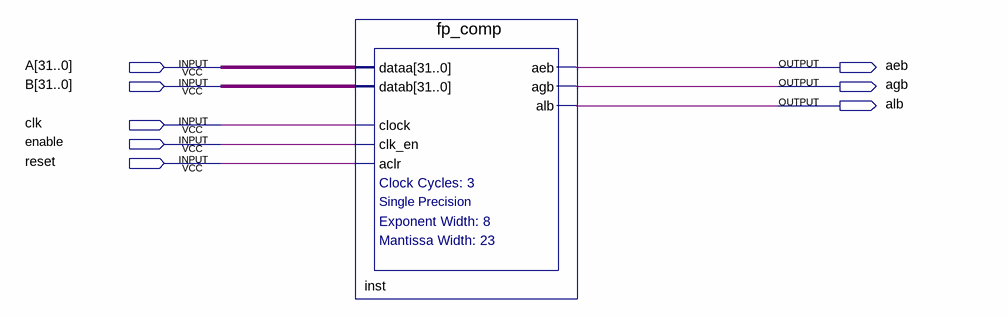
[diagram p0: schematic sheet]
// Quartus schematic fp_comp.bdf as structural Verilog: 1 symbols, 8 pins
module fp_comp (
  input  [31:0] A,
  input  [31:0] B,
  input  clk,
  input  enable,
  input  reset,
  output aeb,
  output agb,
  output alb
);

  fp_comp inst (.dataa(A), .datab(B), .clock(clk), .clk_en(enable), .aclr(reset), .aeb(aeb), .agb(agb), .alb(alb));
endmodule
